# Altium schematic sheet PLL1.SchDoc
size A4
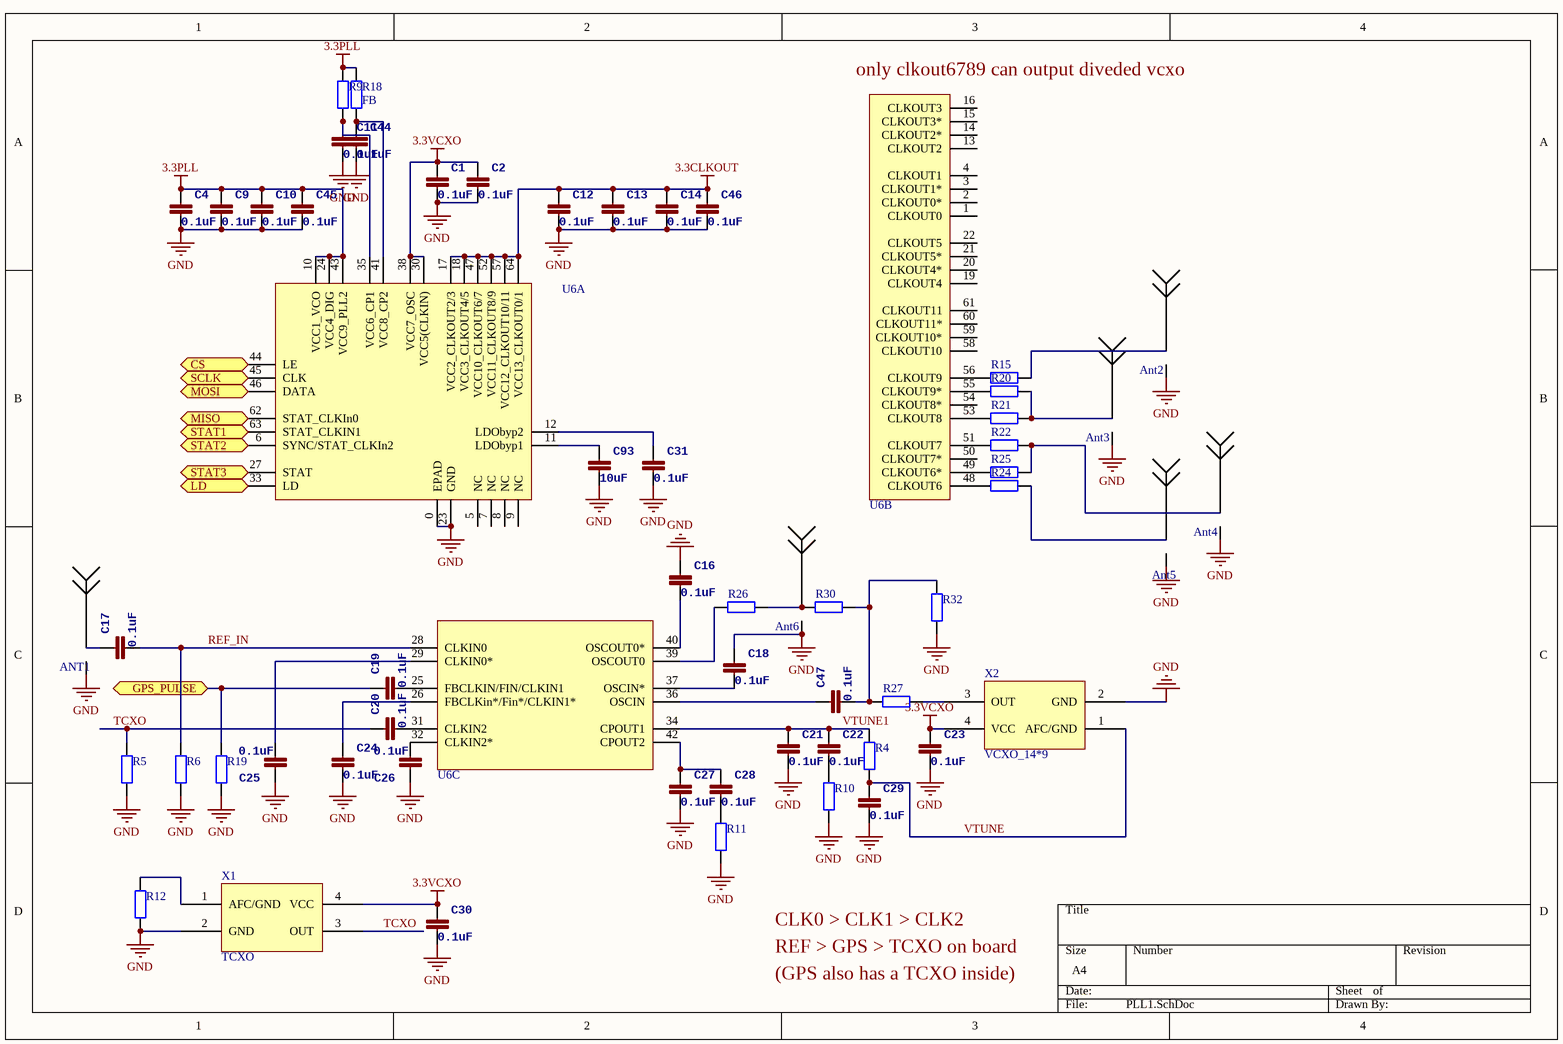
[diagram p0: PLL1.SchDoc]

## Parts
ANT1  Antenna  [SMA-2B]  (value not drawn)
Ant2  Antenna  [SMA-2B]  (value not drawn)
Ant3  Antenna  [SMA-2B]  (value not drawn)
Ant4  Antenna  [SMA-2B]  (value not drawn)
Ant5  Antenna  [SMA-2B]  (value not drawn)
Ant6  Antenna  [SMA-2B]  (value not drawn)
C1  0.1uF  [0402]
C2  0.1uF  [0402]
C4  0.1uF  [0402]
C9  0.1uF  [0402]
C10  0.1uF  [0402]
C11  0.1uF  [0402]
C12  0.1uF  [0402]
C13  0.1uF  [0402]
C14  0.1uF  [0402]
C16  0.1uF  [0402]
C17  0.1uF  [0402]
C18  0.1uF  [0402]
C19  0.1uF  [0402]
C20  0.1uF  [0402]
C21  0.1uF  [0402]
C22  0.1uF  [0402]
C23  0.1uF  [0402]
C24  0.1uF  [0402]
C25  0.1uF  [0402]
C26  0.1uF  [0402]
C27  0.1uF  [0402]
C28  0.1uF  [0402]
C29  0.1uF  [0402]
C30  0.1uF  [0402]
C31  0.1uF  [0402]
C44  0.1uF  [0402]
C45  0.1uF  [0402]
C46  0.1uF  [0402]
C47  0.1uF  [0402]
C93  10uF  [0603L]
R4  (no value)  [0402]
R5  (no value)  [0402]
R6  (no value)  [0402]
R9  (no value)  [0402]
R10  (no value)  [0402]
R11  (no value)  [0402]
R12  (no value)  [0402]
R15  (no value)  [0402]
R18  FB  [0402]
R19  (no value)  [0402]
R20  (no value)  [0402]
R21  (no value)  [0402]
R22  (no value)  [0402]
R24  (no value)  [0402]
R25  (no value)  [0402]
R26  (no value)  [0402]
R27  (no value)  [0402]
R30  (no value)  [0402]
R32  (no value)  [0402]
U6  LMK04816  [LMK04816]  (value not drawn)  (parts A,B,C of 3)
X1  TCXO  [TXC_7Q]
X2  VCXO_14*9  [CRYSTEK-9*14]

## Ports
CS, GPS_PULSE, LD, MISO, MOSI, SCLK, STAT1, STAT2, STAT3

## Nets
3.3CLKOUT: C12.1 C13.1 C14.1 C46.1 U6.17(VCC2_CLKOUT2/3) U6.18(VCC3_CLKOUT4/5) U6.47(VCC10_CLKOUT6/7) U6.52(VCC11_CLKOUT8/9) U6.57(VCC12_CLKOUT10/11) U6.64(VCC13_CLKOUT0/1)
3.3PLL: C4.1 C9.1 C10.1 C45.1 R9.2 R18.2 U6.10(VCC1_VCO) U6.24(VCC4_DIG) U6.43(VCC9_PLL2)
3.3VCXO: C1.1 C2.1 C23.1 C30.1 U6.30(VCC5(CLKIN)) U6.38(VCC7_OSC) X1.4(VCC) X2.4(VCC)
GND: ANT1.GND(G) Ant2.GND(G) Ant3.GND(G) Ant4.GND(G) Ant5.GND(G) Ant6.GND(G) C1.2 C2.2 C4.2 C9.2 C10.2 C11.2 C12.2 C13.2 C14.2 C16.1 C18.1 C21.2 C23.2 C24.2 C25.1 C26.1 C27.2 C29.2 C30.2 C31.2 C44.2 C45.2 C46.2 C93.2 R5.1 R6.2 R10.2 R11.2 R12.2 R19.1 R32.2 U6.0(EPAD) U6.23(GND) X1.2(GND) X2.2(GND)
CS: U6.44(LE) ; port CS
GPS_PULSE: C19.1 R19.2 ; port GPS_PULSE
LD: U6.33(LD) ; port LD
MISO: U6.62(STAT_CLKIn0) ; port MISO
MOSI: U6.46(DATA) ; port MOSI
REF_IN: C17.2 R6.1 U6.28(CLKIN0)
SCLK: U6.45(CLK) ; port SCLK
STAT1: U6.63(STAT_CLKIN1) ; port STAT1
STAT2: U6.6(SYNC/STAT_CLKIn2) ; port STAT2
STAT3: U6.27(STAT) ; port STAT3
TCXO: C20.1 R5.2 X1.3(OUT)
VTUNE: C29.1 R4.2 X2.1(AFC/GND)
VTUNE1: C21.1 C22.1 R4.1 U6.34(CPOUT1)
NetANT1_1: ANT1.1 C17.1
NetAnt2_1: Ant2.1 R15.2
NetAnt3_1: Ant3.1 R20.2 R21.2
NetAnt4_1: Ant4.1 R22.2 R25.2
NetAnt5_1: Ant5.1 R24.2
NetAnt6_1: Ant6.1 R26.2 R30.1
NetC11_1: C11.1 R9.1 U6.35(VCC6_CP1)
NetC16_2: C16.2 U6.40(OSCOUT0*)
NetC18_2: C18.2 U6.37(OSCIN*)
NetC19_2: C19.2 U6.25(FBCLKIN/FIN/CLKIN1)
NetC20_2: C20.2 U6.31(CLKIN2)
NetC22_2: C22.2 R10.1
NetC24_1: C24.1 U6.26(FBCLKin*/Fin*/CLKIN1*)
NetC25_2: C25.2 U6.29(CLKIN0*)
NetC26_2: C26.2 U6.32(CLKIN2*)
NetC27_1: C27.1 C28.1 U6.42(CPOUT2)
NetC28_2: C28.2 R11.1
NetC31_1: C31.1 U6.12(LDObyp2)
NetC44_1: C44.1 R18.1 U6.41(VCC8_CP2)
NetC47_1: C47.1 U6.36(OSCIN)
NetC47_2: C47.2 R27.1 R30.2 R32.1
NetC93_1: C93.1 U6.11(LDObyp1)
NetR12_1: R12.1 X1.1(AFC/GND)
NetR15_1: R15.1 U6.56(CLKOUT9)
NetR20_1: R20.1 U6.55(CLKOUT9*)
NetR21_1: R21.1 U6.53(CLKOUT8)
NetR22_1: R22.1 U6.51(CLKOUT7)
NetR24_1: R24.1 U6.48(CLKOUT6)
NetR25_1: R25.1 U6.49(CLKOUT6*)
NetR26_1: R26.1 U6.39(OSCOUT0)
NetR27_2: R27.2 X2.3(OUT)

Not connected (* = marked no-connect by the designer): U6 1(CLKOUT0) 2(CLKOUT0*) 3(CLKOUT1*) 4(CLKOUT1) 5(NC) 7(NC) 8(NC) 9(NC) 13(CLKOUT2) 14(CLKOUT2*) 15(CLKOUT3*) 16(CLKOUT3) 19(CLKOUT4) 20(CLKOUT4*) 21(CLKOUT5*) 22(CLKOUT5) 50(CLKOUT7*) 54(CLKOUT8*) 58(CLKOUT10) 59(CLKOUT10*) 60(CLKOUT11*) 61(CLKOUT11)

## Notes on the sheet
- (near U6) only clkout6789 can output diveded vcxo
- CLK0 > CLK1 > CLK2
- (GPS also has a TCXO inside)
- REF > GPS > TCXO on board

## Library data of the parts
C1 C2 C4 C9-C14 C16-C31 C44-C47 C93 = CAP0402-CAP: <b>Capacitor</b> / Standard 0603 ceramic capacitor, and 0.1" leaded capacitor.; PARTNO: CC0402ZRY5V7BB104
R4-R6 R9-R12 R15 R19-R22 R24-R27 R30 R32 = Res2: Resistor; Value: 0R; Published: 8-Jun-2000; LatestRevisionDate: 17-Jul-2002; LatestRevisionNote: Re-released for DXP Platform.; PackageReference: AXIAL-0.4; Publisher: Altium Limited; PackageDescription: Axial Device, Thru-Hole; 2 Leads; 0.4 in Pin Spacing
R18 = Res2: Resistor; Published: 8-Jun-2000; LatestRevisionDate: 17-Jul-2002; LatestRevisionNote: Re-released for DXP Platform.; PackageReference: AXIAL-0.4; Publisher: Altium Limited; PackageDescription: Axial Device, Thru-Hole; 2 Leads; 0.4 in Pin Spacing
X1 X2 = OSC_40M